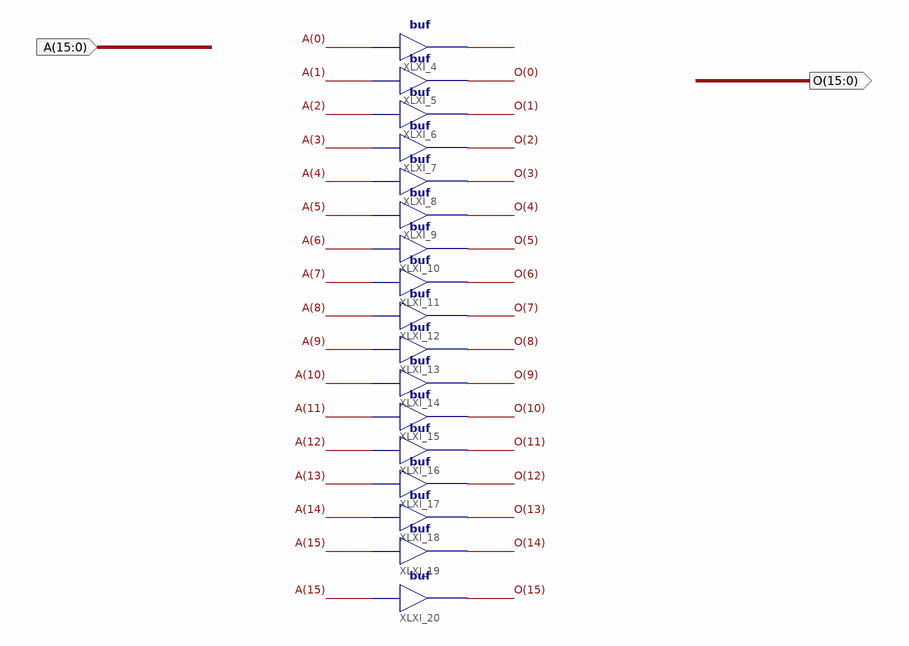
[diagram p0: schematic sheet 1]
// Xilinx ISE schematic ShiftRA1b.sch (spartan3e) as structural Verilog: 17 symbols, 2 ports
module ShiftRA1b (
  input  [15:0] A,
  output [15:0] O
);

  wire XLXN_4;

  buf XLXI_4 (XLXN_4, A[0]);
  buf XLXI_5 (O[0], A[1]);
  buf XLXI_6 (O[1], A[2]);
  buf XLXI_7 (O[2], A[3]);
  buf XLXI_8 (O[3], A[4]);
  buf XLXI_9 (O[4], A[5]);
  buf XLXI_10 (O[5], A[6]);
  buf XLXI_11 (O[6], A[7]);
  buf XLXI_12 (O[7], A[8]);
  buf XLXI_13 (O[8], A[9]);
  buf XLXI_14 (O[9], A[10]);
  buf XLXI_15 (O[10], A[11]);
  buf XLXI_16 (O[11], A[12]);
  buf XLXI_17 (O[12], A[13]);
  buf XLXI_18 (O[13], A[14]);
  buf XLXI_19 (O[14], A[15]);
  buf XLXI_20 (O[15], A[15]);
endmodule
